# Altium schematic sheet 00_MCU_IO.SchDoc
size A2; SheetNumber: 1; SheetTotal: 5
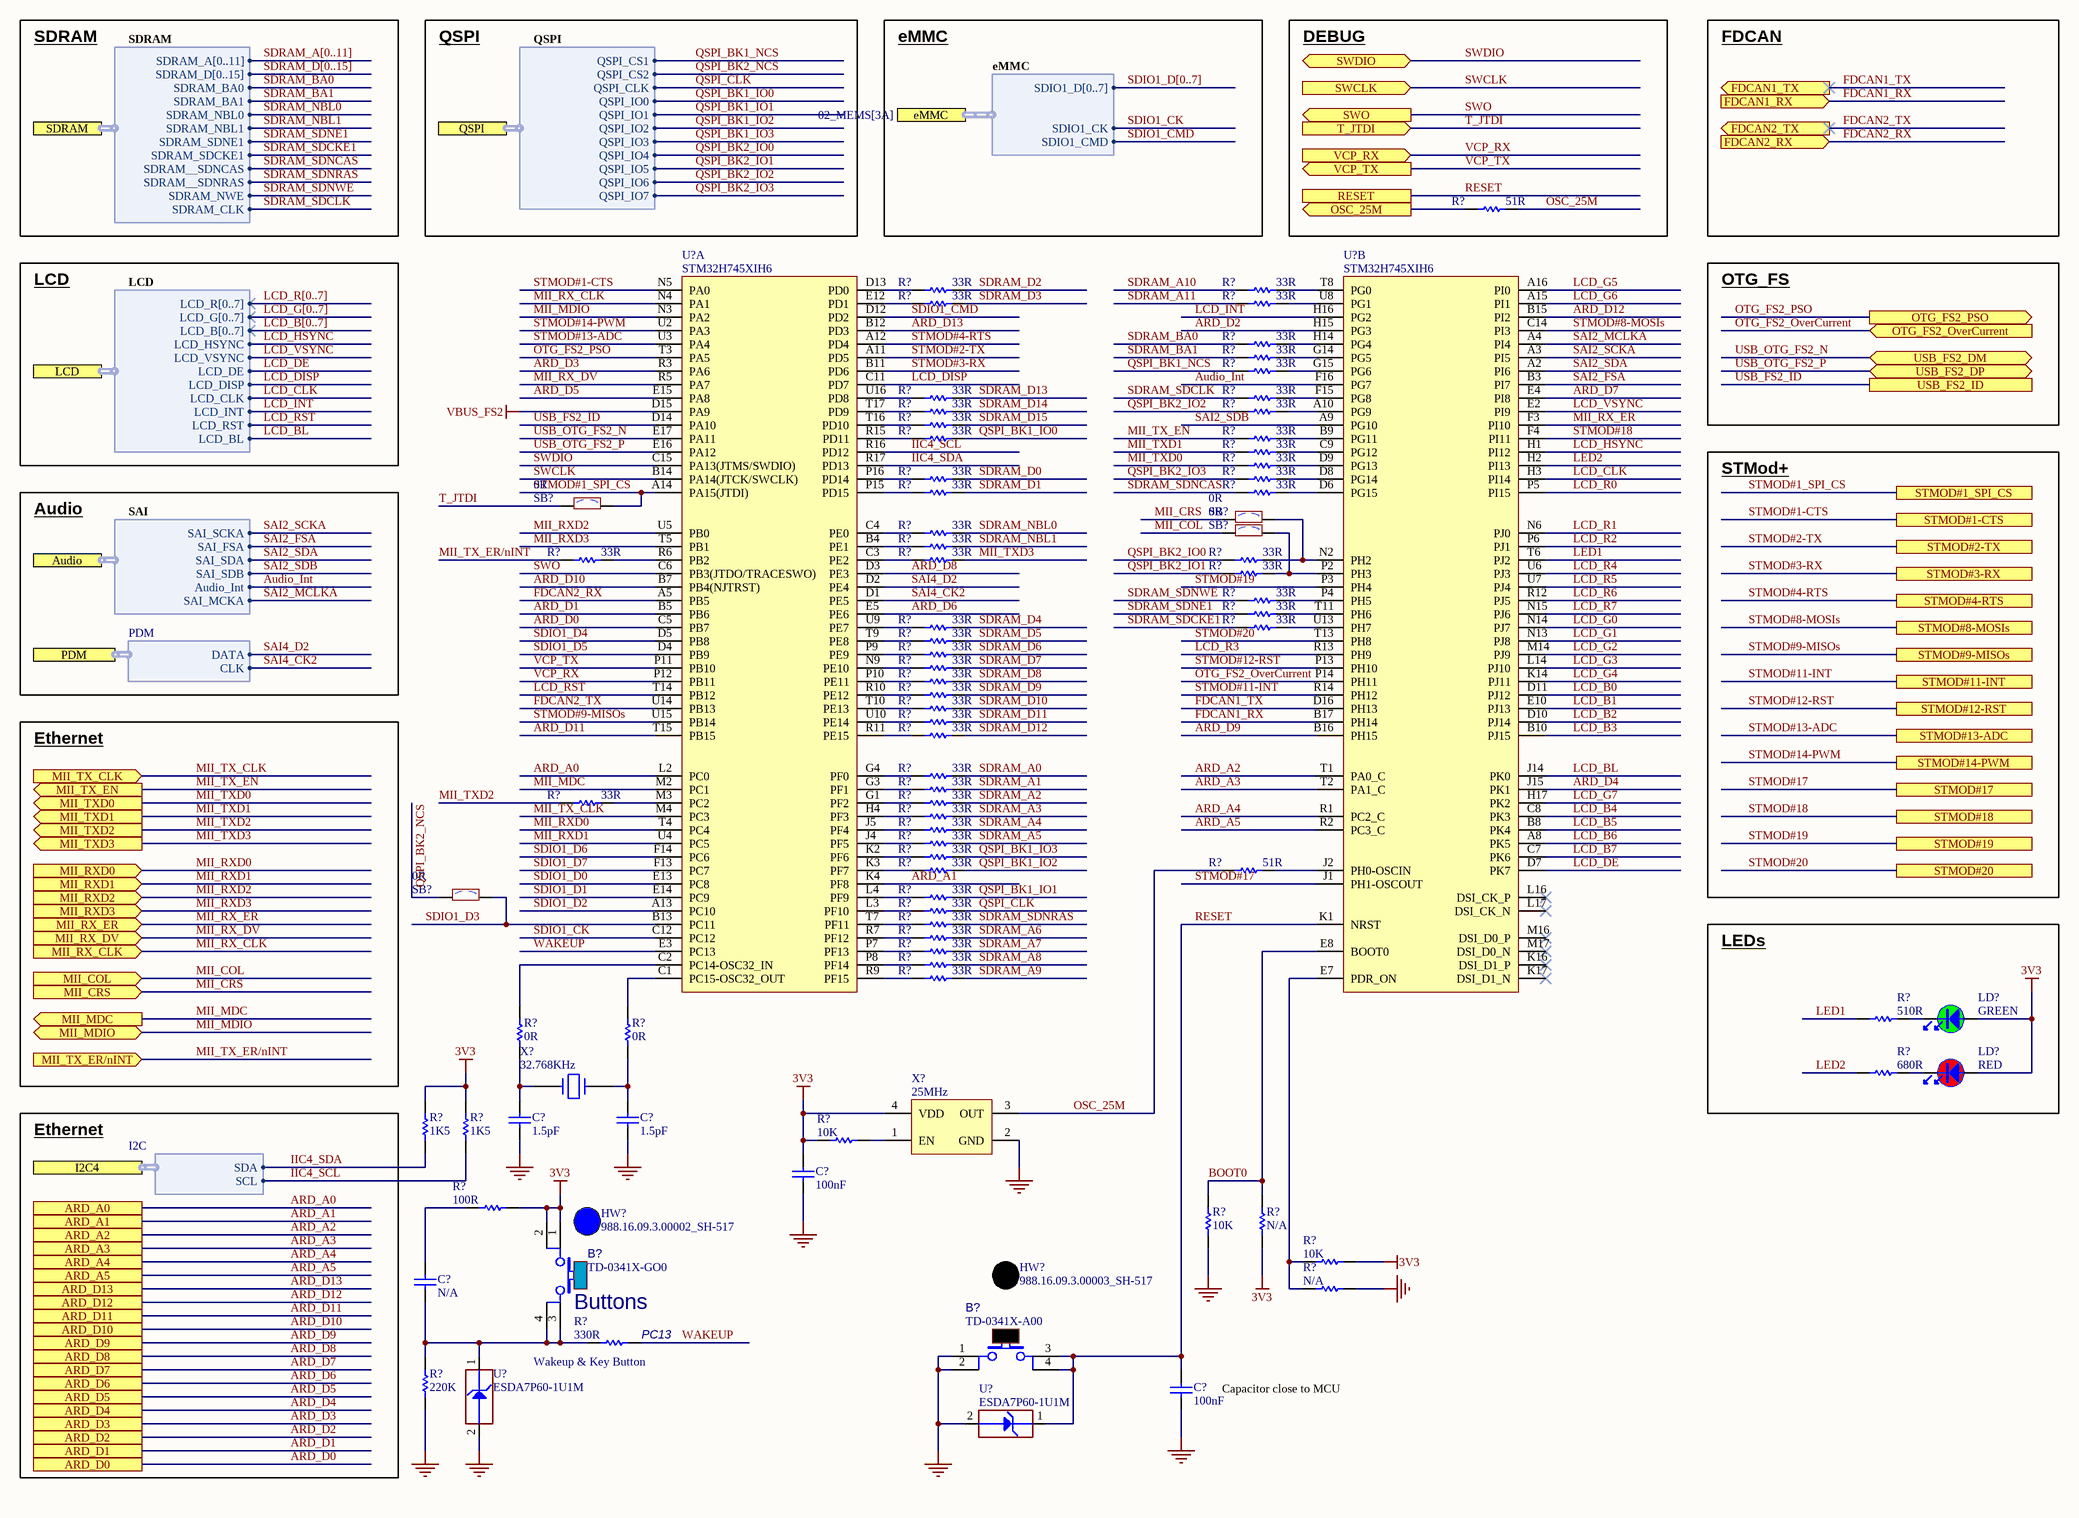
[diagram p0: 00_MCU_IO.SchDoc]

## Parts
(Parts that share a designator on the sheet are numbered #1, #2 ... from top to bottom, then left to right.)
B?#1  Manufacturer_Part_Number: TD-0341X-GO0  [SWI_WEALTHMETAL_TD-0341_4P_BLUE]  (hidden comment: SW-PUSH-CMS_BLUE)
B?#2  Manufacturer_Part_Number: TD-0341X-A00  [SWI_WEALTHMETAL_TD-0341_4P_BLACK]  (hidden comment: SW-PUSH-CMS_BLACK)
C?#1  value 1.5pF  [C0402]  (hidden comment: Capacitor)
C?#2  value 1.5pF  [C0402]  (hidden comment: Capacitor)
C?#3  value 100nF  [C0402]  (hidden comment: Capacitor)
C?#4  N/A  [C0402]
C?#5  value 100nF  [C0402]  (hidden comment: Capacitor)
HW?#1  value 988.16.09.3.00002_SH-517  (hidden comment: BUTTON_HAT_BLUE)  (mechanical)
HW?#2  value 988.16.09.3.00003_SH-517  (hidden comment: BUTTON_HAT_BLACK)  (mechanical)
LD?#1  value GREEN  [LED_0603_GREEN]  (hidden comment: LED_green)
LD?#2  value RED  [LED_0603_RED]  (hidden comment: LED_red)
R?#1  value 51R  [R0402]  (hidden comment: Resistor)
R?#2  value 33R  [R0402]  (hidden comment: Resistor)
R?#3  value 33R  [R0402]  (hidden comment: Resistor)
R?#4  value 33R  [R0402]  (hidden comment: Resistor)
R?#5  value 33R  [R0402]  (hidden comment: Resistor)
R?#6  value 33R  [R0402]  (hidden comment: Resistor)
R?#7  value 33R  [R0402]  (hidden comment: Resistor)
R?#8  value 33R  [R0402]  (hidden comment: Resistor)
R?#9  value 33R  [R0402]  (hidden comment: Resistor)
R?#10  value 33R  [R0402]  (hidden comment: Resistor)
R?#11  value 33R  [R0402]  (hidden comment: Resistor)
R?#12  value 33R  [R0402]  (hidden comment: Resistor)
R?#13  value 33R  [R0402]  (hidden comment: Resistor)
R?#14  value 33R  [R0402]  (hidden comment: Resistor)
R?#15  value 33R  [R0402]  (hidden comment: Resistor)
R?#16  value 33R  [R0402]  (hidden comment: Resistor)
R?#17  value 33R  [R0402]  (hidden comment: Resistor)
R?#18  value 33R  [R0402]  (hidden comment: Resistor)
R?#19  value 33R  [R0402]  (hidden comment: Resistor)
R?#20  value 33R  [R0402]  (hidden comment: Resistor)
R?#21  value 33R  [R0402]  (hidden comment: Resistor)
R?#22  value 33R  [R0402]  (hidden comment: Resistor)
R?#23  value 33R  [R0402]  (hidden comment: Resistor)
R?#24  value 33R  [R0402]  (hidden comment: Resistor)
R?#25  value 33R  [R0402]  (hidden comment: Resistor)
R?#26  value 33R  [R0402]  (hidden comment: Resistor)
R?#27  value 33R  [R0402]  (hidden comment: Resistor)
R?#28  value 33R  [R0402]  (hidden comment: Resistor)
R?#29  value 33R  [R0402]  (hidden comment: Resistor)
R?#30  value 33R  [R0402]  (hidden comment: Resistor)
R?#31  value 33R  [R0402]  (hidden comment: Resistor)
R?#32  value 33R  [R0402]  (hidden comment: Resistor)
R?#33  value 33R  [R0402]  (hidden comment: Resistor)
R?#34  value 33R  [R0402]  (hidden comment: Resistor)
R?#35  value 33R  [R0402]  (hidden comment: Resistor)
R?#36  value 33R  [R0402]  (hidden comment: Resistor)
R?#37  value 33R  [R0402]  (hidden comment: Resistor)
R?#38  value 33R  [R0402]  (hidden comment: Resistor)
R?#39  value 33R  [R0402]  (hidden comment: Resistor)
R?#40  value 33R  [R0402]  (hidden comment: Resistor)
R?#41  value 33R  [R0402]  (hidden comment: Resistor)
R?#42  value 33R  [R0402]  (hidden comment: Resistor)
R?#43  value 33R  [R0402]  (hidden comment: Resistor)
R?#44  value 33R  [R0402]  (hidden comment: Resistor)
R?#45  value 33R  [R0402]  (hidden comment: Resistor)
R?#46  value 33R  [R0402]  (hidden comment: Resistor)
R?#47  value 33R  [R0402]  (hidden comment: Resistor)
R?#48  value 33R  [R0402]  (hidden comment: Resistor)
R?#49  value 51R  [R0402]  (hidden comment: Resistor)
R?#50  value 33R  [R0402]  (hidden comment: Resistor)
R?#51  value 33R  [R0402]  (hidden comment: Resistor)
R?#52  value 33R  [R0402]  (hidden comment: Resistor)
R?#53  value 33R  [R0402]  (hidden comment: Resistor)
R?#54  value 33R  [R0402]  (hidden comment: Resistor)
R?#55  value 33R  [R0402]  (hidden comment: Resistor)
R?#56  value 33R  [R0402]  (hidden comment: Resistor)
R?#57  value 510R  [R0603]  (hidden comment: Resistor)
R?#58  value 0R  [R0603]  (hidden comment: Resistor)
R?#59  value 0R  [R0603]  (hidden comment: Resistor)
R?#60  value 680R  [R0402]  (hidden comment: Resistor)
R?#61  value 1K5  [R0402]  (hidden comment: Resistor)
R?#62  value 1K5  [R0402]  (hidden comment: Resistor)
R?#63  value 10K  [R0402]  (hidden comment: Resistor)
R?#64  value 100R  [R0402]  (hidden comment: Resistor)
R?#65  value 10K  [R0402]  (hidden comment: Resistor)
R?#66  N/A  [R0402]
R?#67  value 10K  [R0402]  (hidden comment: Resistor)
R?#68  N/A  [R0402]
R?#69  value 330R  [R0402]  (hidden comment: Resistor)
R?#70  value 220K  [R0402]  (hidden comment: Resistor)
SB?#1  value 0R  [SOLDER-BRIDGE_R0603-0R]  (hidden comment: SB_OFF)
SB?#2  value 0R  [SOLDER-BRIDGE_R0603-0R]  (hidden comment: SB_OFF)
SB?#3  value 0R  [SOLDER-BRIDGE_R0603-0R]  (hidden comment: SB_OFF)
SB?#4  value 0R  [SOLDER-BRIDGE_R0603-0R]  (hidden comment: SB_OFF)
U?#1  value STM32H745XIH6  [ICC_TFBGA240+25_14X14_STM32H745H6U_P080]  (part A of 3)
U?#2  value STM32H745XIH6  [ICC_TFBGA240+25_14X14_STM32H745H6U_P080]  (part B of 3)
U?#3  value ESDA7P60-1U1M  [ESD_QFN2_1P6X1_P125]  (hidden comment: ESD-TRANSIL)
U?#4  value ESDA7P60-1U1M  [ESD_QFN2_1P6X1_P125]  (hidden comment: ESD-TRANSIL)
X?#1  value 32.768KHz  [CRY_NX3215SA_2P]  (hidden comment: XTAL_32K_NX3215SA)
X?#2  value 25MHz  [OSC_NDK_NZ2520SB_4P]  (hidden comment: Oscillator_4pins)

## Blocks framed on the sheet
DEBUG: R?#1
LEDs: LD?#1 LD?#2 R?#57 R?#60

## Ports
ARD_A0, ARD_A1, ARD_A2, ARD_A3, ARD_A4, ARD_A5, ARD_D0, ARD_D1, ARD_D2, ARD_D3, ARD_D4, ARD_D5, ARD_D6, ARD_D7, ARD_D8, ARD_D9, ARD_D10, ARD_D11, ARD_D12, ARD_D13, Audio (harness SAI), eMMC (harness eMMC, see 02_MEMS[3A]), FDCAN1_RX (in), FDCAN1_TX (out), FDCAN2_RX (in), FDCAN2_TX (out), I2C4 (harness I2C), LCD (harness LCD), MII_COL (in), MII_CRS (in), MII_MDC (out), MII_MDIO (bidir), MII_RX_CLK (in), MII_RX_DV (in), MII_RX_ER (in), MII_RXD0 (in), MII_RXD1 (in), MII_RXD2 (in), MII_RXD3 (in), MII_TX_CLK (in), MII_TX_EN (out), MII_TX_ER/nINT (in), MII_TXD0 (out), MII_TXD1 (out), MII_TXD2 (out), MII_TXD3 (out), OSC_25M (out), OTG_FS2_OverCurrent (in), OTG_FS2_PSO (out), PDM (harness PDM), QSPI (harness QSPI), RESET, SDRAM (harness SDRAM), STMOD#1-CTS, STMOD#1_SPI_CS, STMOD#2-TX, STMOD#3-RX, STMOD#4-RTS, STMOD#8-MOSIs, STMOD#9-MISOs, STMOD#11-INT, STMOD#12-RST, STMOD#13-ADC, STMOD#14-PWM, STMOD#17, STMOD#18, STMOD#19, STMOD#20, SWCLK (in), SWDIO (bidir), SWO (out), T_JTDI (in), USB_FS2_DM (bidir), USB_FS2_DP (bidir), USB_FS2_ID, VCP_RX (in), VCP_TX (out)

## Harnesses
SDRAM: SDRAM_A[0..11], SDRAM__SDNCAS, SDRAM_NBL0, SDRAM_SDNE1, SDRAM_SDCKE1, SDRAM_D[0..15], SDRAM_NBL1, SDRAM_BA0, SDRAM_BA1, SDRAM_NWE, SDRAM_CLK, SDRAM__SDNRAS
LCD: LCD_R[0..7], LCD_G[0..7], LCD_B[0..7], LCD_HSYNC, LCD_VSYNC, LCD_DE, LCD_DISP, LCD_CLK, LCD_INT, LCD_BL, LCD_RST
QSPI: QSPI_IO1, QSPI_IO0, QSPI_CLK, QSPI_CS1, QSPI_IO2, QSPI_IO3, QSPI_IO5, QSPI_IO4, QSPI_IO6, QSPI_IO7, QSPI_CS2
eMMC: SDIO1_D[0..7], SDIO1_CMD, SDIO1_CK
SAI: SAI_SDB, SAI_FSA, Audio_Int, SAI_SDA, SAI_SCKA, SAI_MCKA
I2C: SDA, SCL
PDM: DATA, CLK

## Nets
3V3: B?#1.1 B?#1.2 C?#3.2 LD?#1.1 LD?#2.1 R?#61.2 R?#62.2 R?#63.2 R?#64.2 R?#66.1 R?#67.1 X?#2.4(VDD)
GND: B?#2.1 B?#2.2 C?#1.1 C?#2.1 C?#3.1 C?#5.1 R?#65.2 R?#68.1 R?#70.1 U?#3.2(GND) U?#4.2(GND) X?#2.2(GND)
VBUS_FS2: U?#1.D15(PA9)
ARD_A0: U?#1.L2(PC0) ; port ARD_A0
ARD_A1: U?#1.K4(PF8) ; port ARD_A1
ARD_A2: U?#2.T1(PA0_C) ; port ARD_A2
ARD_A3: U?#2.T2(PA1_C) ; port ARD_A3
ARD_A4: U?#2.R1(PC2_C) ; port ARD_A4
ARD_A5: U?#2.R2(PC3_C) ; port ARD_A5
ARD_D0: U?#1.C5(PB7) ; port ARD_D0
ARD_D1: U?#1.B5(PB6) ; port ARD_D1
ARD_D2: U?#2.H15(PG3) ; port ARD_D2
ARD_D3: U?#1.R3(PA6) ; port ARD_D3
ARD_D4: U?#2.J15(PK1) ; port ARD_D4
ARD_D5: U?#1.E15(PA8) ; port ARD_D5
ARD_D6: U?#1.E5(PE6) ; port ARD_D6
ARD_D7: U?#2.E4(PI8) ; port ARD_D7
ARD_D8: U?#1.D3(PE3) ; port ARD_D8
ARD_D9: U?#2.B16(PH15) ; port ARD_D9
ARD_D10: U?#1.B7(PB4(NJTRST)) ; port ARD_D10
ARD_D11: U?#1.T15(PB15) ; port ARD_D11
ARD_D12: U?#2.B15(PI2) ; port ARD_D12
ARD_D13: U?#1.B12(PD3) ; port ARD_D13
Audio_Int: U?#2.F16(PG7) ; port Audio.Audio_Int
BOOT0: R?#65.1 R?#66.2 U?#2.E8(BOOT0)
FDCAN1_RX: U?#2.B17(PH14) ; port FDCAN1_RX
FDCAN1_TX: U?#2.D16(PH13) ; port FDCAN1_TX
FDCAN2_RX: U?#1.A5(PB5) ; port FDCAN2_RX
FDCAN2_TX: U?#1.U14(PB13) ; port FDCAN2_TX
IIC4_SCL: R?#62.1 U?#1.R16(PD12) ; port I2C4.SCL
IIC4_SDA: R?#61.1 U?#1.R17(PD13) ; port I2C4.SDA
LCD_B0: U?#2.D11(PJ12)
LCD_B1: U?#2.E10(PJ13)
LCD_B2: U?#2.D10(PJ14)
LCD_B3: U?#2.B10(PJ15)
LCD_B4: U?#2.C8(PK3)
LCD_B5: U?#2.B8(PK4)
LCD_B6: U?#2.A8(PK5)
LCD_B7: U?#2.C7(PK6)
LCD_BL: U?#2.J14(PK0) ; port LCD.LCD_BL
LCD_CLK: U?#2.H3(PI14) ; port LCD.LCD_CLK
LCD_DE: U?#2.D7(PK7) ; port LCD.LCD_DE
LCD_DISP: U?#1.C11(PD7) ; port LCD.LCD_DISP
LCD_G0: U?#2.N14(PJ7)
LCD_G1: U?#2.N13(PJ8)
LCD_G2: U?#2.M14(PJ9)
LCD_G3: U?#2.L14(PJ10)
LCD_G4: U?#2.K14(PJ11)
LCD_G5: U?#2.A16(PI0)
LCD_G6: U?#2.A15(PI1)
LCD_G7: U?#2.H17(PK2)
LCD_HSYNC: U?#2.H1(PI12) ; port LCD.LCD_HSYNC
LCD_INT: U?#2.H16(PG2) ; port LCD.LCD_INT
LCD_R0: U?#2.P5(PI15)
LCD_R1: U?#2.N6(PJ0)
LCD_R2: U?#2.P6(PJ1)
LCD_R3: U?#2.R13(PH9)
LCD_R4: U?#2.U6(PJ3)
LCD_R5: U?#2.U7(PJ4)
LCD_R6: U?#2.R12(PJ5)
LCD_R7: U?#2.N15(PJ6)
LCD_RST: U?#1.T14(PB12) ; port LCD.LCD_RST
LCD_VSYNC: U?#2.E2(PI9) ; port LCD.LCD_VSYNC
LED1: R?#57.1 U?#2.T6(PJ2)
LED2: R?#60.1 U?#2.H2(PI13)
MII_COL: SB?#3.1 ; port MII_COL
MII_CRS: SB?#2.1 ; port MII_CRS
MII_MDC: U?#1.M2(PC1) ; port MII_MDC
MII_MDIO: U?#1.N3(PA2) ; port MII_MDIO
MII_RX_CLK: U?#1.N4(PA1) ; port MII_RX_CLK
MII_RX_DV: U?#1.R5(PA7) ; port MII_RX_DV
MII_RX_ER: U?#2.F3(PI10) ; port MII_RX_ER
MII_RXD0: U?#1.T4(PC4) ; port MII_RXD0
MII_RXD1: U?#1.U4(PC5) ; port MII_RXD1
MII_RXD2: U?#1.U5(PB0) ; port MII_RXD2
MII_RXD3: U?#1.T5(PB1) ; port MII_RXD3
MII_TX_CLK: U?#1.M4(PC3) ; port MII_TX_CLK
MII_TX_EN: R?#15.1 ; port MII_TX_EN
MII_TX_ER/nINT: R?#24.1 ; port MII_TX_ER/nINT
MII_TXD0: R?#17.1 ; port MII_TXD0
MII_TXD1: R?#16.1 ; port MII_TXD1
MII_TXD2: R?#42.1 ; port MII_TXD2
MII_TXD3: R?#25.2 ; port MII_TXD3
OSC_25M: R?#1.2 R?#49.1 X?#2.3(OUT)
OSC_25M: R?#1.1 ; port OSC_25M  [a separate net that carries the same name]
OTG_FS2_OverCurrent: U?#2.P14(PH11) ; port OTG_FS2_OverCurrent
OTG_FS2_PSO: U?#1.T3(PA5) ; port OTG_FS2_PSO
QSPI_BK1_IO0: R?#14.2 ; port QSPI.QSPI_IO0
QSPI_BK1_IO1: R?#50.2 ; port QSPI.QSPI_IO1
QSPI_BK1_IO2: R?#48.2 ; port QSPI.QSPI_IO2
QSPI_BK1_IO3: R?#47.2 ; port QSPI.QSPI_IO3
QSPI_BK1_NCS: R?#8.1 ; port QSPI.QSPI_CS1
QSPI_BK2_IO0: R?#26.1 ; port QSPI.QSPI_IO4
QSPI_BK2_IO1: R?#27.1 ; port QSPI.QSPI_IO5
QSPI_BK2_IO2: R?#12.1 ; port QSPI.QSPI_IO6
QSPI_BK2_IO3: R?#19.1 ; port QSPI.QSPI_IO7
QSPI_BK2_NCS: SB?#4.1 ; port QSPI.QSPI_CS2
QSPI_CLK: R?#51.2 ; port QSPI.QSPI_CLK
RESET: B?#2.3 B?#2.4 C?#5.2 U?#2.K1(NRST) U?#4.1(IO1) ; port RESET
SAI2_FSA: U?#2.B3(PI7) ; port Audio.SAI_FSA
SAI2_MCLKA: U?#2.A4(PI4) ; port Audio.SAI_MCKA
SAI2_SCKA: U?#2.A3(PI5) ; port Audio.SAI_SCKA
SAI2_SDA: U?#2.A2(PI6) ; port Audio.SAI_SDA
SAI2_SDB: U?#2.A9(PG10) ; port Audio.SAI_SDB
SAI4_CK2: U?#1.D1(PE5) ; port PDM.CLK
SAI4_D2: U?#1.D2(PE4) ; port PDM.DATA
SDIO1_CK: U?#1.C12(PC12) ; port eMMC.SDIO1_CK
SDIO1_CMD: U?#1.D12(PD2) ; port eMMC.SDIO1_CMD
SDIO1_D0: U?#1.E13(PC8)
SDIO1_D1: U?#1.E14(PC9)
SDIO1_D2: U?#1.A13(PC10)
SDIO1_D3: SB?#4.2 U?#1.B13(PC11)
SDIO1_D4: U?#1.D5(PB8)
SDIO1_D5: U?#1.D4(PB9)
SDIO1_D6: U?#1.F14(PC6)
SDIO1_D7: U?#1.F13(PC7)
SDRAM_A0: R?#40.2
SDRAM_A1: R?#41.2
SDRAM_A2: R?#43.2
SDRAM_A3: R?#44.2
SDRAM_A4: R?#45.2
SDRAM_A5: R?#46.2
SDRAM_A6: R?#53.2
SDRAM_A7: R?#54.2
SDRAM_A8: R?#55.2
SDRAM_A9: R?#56.2
SDRAM_A10: R?#3.1
SDRAM_A11: R?#5.1
SDRAM_BA0: R?#6.1 ; port SDRAM.SDRAM_BA0
SDRAM_BA1: R?#7.1 ; port SDRAM.SDRAM_BA1
SDRAM_D0: R?#18.2
SDRAM_D1: R?#20.2
SDRAM_D2: R?#2.2
SDRAM_D3: R?#4.2
SDRAM_D4: R?#30.2
SDRAM_D5: R?#32.2
SDRAM_D6: R?#33.2
SDRAM_D7: R?#34.2
SDRAM_D8: R?#35.2
SDRAM_D9: R?#36.2
SDRAM_D10: R?#37.2
SDRAM_D11: R?#38.2
SDRAM_D12: R?#39.2
SDRAM_D13: R?#9.2
SDRAM_D14: R?#11.2
SDRAM_D15: R?#13.2
SDRAM_NBL0: R?#22.2 ; port SDRAM.SDRAM_NBL0
SDRAM_NBL1: R?#23.2 ; port SDRAM.SDRAM_NBL1
SDRAM_SDCKE1: R?#31.1 ; port SDRAM.SDRAM_SDCKE1
SDRAM_SDCLK: R?#10.1 ; port SDRAM.SDRAM_CLK
SDRAM_SDNCAS: R?#21.1 ; port SDRAM.SDRAM__SDNCAS
SDRAM_SDNE1: R?#29.1 ; port SDRAM.SDRAM_SDNE1
SDRAM_SDNRAS: R?#52.2 ; port SDRAM.SDRAM__SDNRAS
SDRAM_SDNWE: R?#28.1 ; port SDRAM.SDRAM_NWE
STMOD#1-CTS: U?#1.N5(PA0) ; port STMOD#1-CTS
STMOD#1_SPI_CS: SB?#1.2 U?#1.A14(PA15(JTDI)) ; port STMOD#1_SPI_CS
STMOD#2-TX: U?#1.A11(PD5) ; port STMOD#2-TX
STMOD#3-RX: U?#1.B11(PD6) ; port STMOD#3-RX
STMOD#4-RTS: U?#1.A12(PD4) ; port STMOD#4-RTS
STMOD#8-MOSIs: U?#2.C14(PI3) ; port STMOD#8-MOSIs
STMOD#9-MISOs: U?#1.U15(PB14) ; port STMOD#9-MISOs
STMOD#11-INT: U?#2.R14(PH12) ; port STMOD#11-INT
STMOD#12-RST: U?#2.P13(PH10) ; port STMOD#12-RST
STMOD#13-ADC: U?#1.U3(PA4) ; port STMOD#13-ADC
STMOD#14-PWM: U?#1.U2(PA3) ; port STMOD#14-PWM
STMOD#17: U?#2.J1(PH1-OSCOUT) ; port STMOD#17
STMOD#18: U?#2.F4(PI11) ; port STMOD#18
STMOD#19: U?#2.P3(PH4) ; port STMOD#19
STMOD#20: U?#2.T13(PH8) ; port STMOD#20
SWCLK: U?#1.B14(PA14(JTCK/SWCLK)) ; port SWCLK
SWDIO: U?#1.C15(PA13(JTMS/SWDIO)) ; port SWDIO
SWO: U?#1.C6(PB3(JTDO/TRACESWO)) ; port SWO
T_JTDI: SB?#1.1 ; port T_JTDI
USB_FS2_ID: U?#1.D14(PA10) ; port USB_FS2_ID
USB_OTG_FS2_N: U?#1.E17(PA11) ; port USB_FS2_DM
USB_OTG_FS2_P: U?#1.E16(PA12) ; port USB_FS2_DP
VCP_RX: U?#1.P12(PB11) ; port VCP_RX
VCP_TX: U?#1.P11(PB10) ; port VCP_TX
WAKEUP: R?#69.2 U?#1.E3(PC13)
NetB?#1_3: B?#1.3 B?#1.4 C?#4.2 R?#69.1 R?#70.2 U?#3.1(IO1)
NetC?#1_2: C?#1.2 R?#58.2 X?#1.1
NetC?#2_2: C?#2.2 R?#59.2 X?#1.2
NetC?#4_1: C?#4.1 R?#64.1
NetLD?#1_2: LD?#1.2 R?#57.2
NetLD?#2_2: LD?#2.2 R?#60.2
NetR?#2_1: R?#2.1 U?#1.D13(PD0)
NetR?#3_2: R?#3.2 U?#2.T8(PG0)
NetR?#4_1: R?#4.1 U?#1.E12(PD1)
NetR?#5_2: R?#5.2 U?#2.U8(PG1)
NetR?#6_2: R?#6.2 U?#2.H14(PG4)
NetR?#7_2: R?#7.2 U?#2.G14(PG5)
NetR?#8_2: R?#8.2 U?#2.G15(PG6)
NetR?#9_1: R?#9.1 U?#1.U16(PD8)
NetR?#10_2: R?#10.2 U?#2.F15(PG8)
NetR?#11_1: R?#11.1 U?#1.T17(PD9)
NetR?#12_2: R?#12.2 U?#2.A10(PG9)
NetR?#13_1: R?#13.1 U?#1.T16(PD10)
NetR?#14_1: R?#14.1 U?#1.R15(PD11)
NetR?#15_2: R?#15.2 U?#2.B9(PG11)
NetR?#16_2: R?#16.2 U?#2.C9(PG12)
NetR?#17_2: R?#17.2 U?#2.D9(PG13)
NetR?#18_1: R?#18.1 U?#1.P16(PD14)
NetR?#19_2: R?#19.2 U?#2.D8(PG14)
NetR?#20_1: R?#20.1 U?#1.P15(PD15)
NetR?#21_2: R?#21.2 U?#2.D6(PG15)
NetR?#22_1: R?#22.1 U?#1.C4(PE0)
NetR?#23_1: R?#23.1 U?#1.B4(PE1)
NetR?#24_2: R?#24.2 U?#1.R6(PB2)
NetR?#25_1: R?#25.1 U?#1.C3(PE2)
NetR?#26_2: R?#26.2 SB?#2.2 U?#2.N2(PH2)
NetR?#27_2: R?#27.2 SB?#3.2 U?#2.P2(PH3)
NetR?#28_2: R?#28.2 U?#2.P4(PH5)
NetR?#29_2: R?#29.2 U?#2.T11(PH6)
NetR?#30_1: R?#30.1 U?#1.U9(PE7)
NetR?#31_2: R?#31.2 U?#2.U13(PH7)
NetR?#32_1: R?#32.1 U?#1.T9(PE8)
NetR?#33_1: R?#33.1 U?#1.P9(PE9)
NetR?#34_1: R?#34.1 U?#1.N9(PE10)
NetR?#35_1: R?#35.1 U?#1.P10(PE11)
NetR?#36_1: R?#36.1 U?#1.R10(PE12)
NetR?#37_1: R?#37.1 U?#1.T10(PE13)
NetR?#38_1: R?#38.1 U?#1.U10(PE14)
NetR?#39_1: R?#39.1 U?#1.R11(PE15)
NetR?#40_1: R?#40.1 U?#1.G4(PF0)
NetR?#41_1: R?#41.1 U?#1.G3(PF1)
NetR?#42_2: R?#42.2 U?#1.M3(PC2)
NetR?#43_1: R?#43.1 U?#1.G1(PF2)
NetR?#44_1: R?#44.1 U?#1.H4(PF3)
NetR?#45_1: R?#45.1 U?#1.J5(PF4)
NetR?#46_1: R?#46.1 U?#1.J4(PF5)
NetR?#47_1: R?#47.1 U?#1.K2(PF6)
NetR?#48_1: R?#48.1 U?#1.K3(PF7)
NetR?#49_2: R?#49.2 U?#2.J2(PH0-OSCIN)
NetR?#50_1: R?#50.1 U?#1.L4(PF9)
NetR?#51_1: R?#51.1 U?#1.L3(PF10)
NetR?#52_1: R?#52.1 U?#1.T7(PF11)
NetR?#53_1: R?#53.1 U?#1.R7(PF12)
NetR?#54_1: R?#54.1 U?#1.P7(PF13)
NetR?#55_1: R?#55.1 U?#1.P8(PF14)
NetR?#56_1: R?#56.1 U?#1.R9(PF15)
NetR?#58_1: R?#58.1 U?#1.C2(PC14-OSC32_IN)
NetR?#59_1: R?#59.1 U?#1.C1(PC15-OSC32_OUT)
NetR?#63_1: R?#63.1 X?#2.1(EN)
NetR?#67_2: R?#67.2 R?#68.2 U?#2.E7(PDR_ON)

Not connected (* = marked no-connect by the designer): U?#2 K16(DSI_D1_P)* K17(DSI_D1_N)* L16(DSI_CK_P)* L17(DSI_CK_N)* M16(DSI_D0_P)* M17(DSI_D0_N)*

## Buses and harness runs
bus LCD_B[0..7]
bus LCD_G[0..7]
bus LCD_R[0..7]
bus SDIO1_D[0..7]
bus SDRAM_A[0..11]
bus SDRAM_D[0..15]

## Notes on the sheet
- SDRAM
- QSPI
- eMMC
- FDCAN
- LCD
- OTG_FS
- Audio
- STMod+
- Ethernet
- (near B?#1) Buttons
- (near R?#69) PC13
- (near R?#69) Wakeup & Key Button
- (near C?#5) Capacitor close to MCU

## Library data of the parts
B?#1 = MCD-00002: Non-Open Push-Button 0.1A 24V BLUE; Part_Type: Misc; Manufacturer: WEALTHMETAL; Part_Preference: Not recommended; Partial_Alternate_Internal_Part_Number: MCD-03589; Value: TD-0341X-GO0; Provided_By: Subcon; Initial_Board_Reference: MB1274; Alternate_EMS: A; Component_Country_Of_Origin: Unknown; ID: 2464; ShowFields: YES; Internal_Part_Number: MCD-00002; Status: Checked; ComponentLink1Description: Datasheet; ComponentLink1URL: http://tunmcdsvn.tun.st.com/Component_Documentation_Library/Trunk/Misc/WEALTHMETAL_TD-0341; Order_Code_Farnell: N/A; Manufacturer_HQ_COO: Unknown; Order_Code_Digikey: N/A; Order_Code_RS: N/A; Package: 6x10mm
B?#2 = MCD-00001: Non-Open Push-Button 0.1A 24V BLACK; Part_Type: Misc; Manufacturer: WEALTHMETAL; Part_Preference: Not recommended; Partial_Alternate_Internal_Part_Number: MCD-03587; Value: TD-0341X-A00; Provided_By: Subcon; Initial_Board_Reference: MB1274; Alternate_EMS: A; Component_Country_Of_Origin: Unknown; ID: 2463; ShowFields: YES; Internal_Part_Number: MCD-00001; Status: Released; ComponentLink1Description: Datasheet; ComponentLink1URL: http://tunmcdsvn.tun.st.com/Component_Documentation_Library/Trunk/Misc/WEALTHMETAL_TD-0341; Order_Code_Farnell: N/A; Order_Code_Digikey: N/A; Order_Code_RS: N/A; Package: 6x10mm
C?#1 C?#2 = MCD-00563: Capacitor, MLCC, 1.5pF, 50V, NPO, +-0.25pF, 0402, T=0,5mm; Manufacturer_Part_Number: CC0402CRNPO9BN1R5; Manufacturer: YAGEO; Part_Preference: Recommended; Partial_Alternate_Internal_Part_Number: MCD-01460; Provided_By: Subcon; Initial_Board_Reference: MB1331; Component_Country_Of_Origin: China; ID: 3175; ShowFields: YES; Internal_Part_Number: MCD-00563; Status: Released; Part_Type: Capacitor; Package: 0402; ComponentLink1Description: Yageo_Capacitor_NP0_16V-to-50V.pdf; ComponentLink1URL: http://tunmcdsvn.tun.st.com/Component_Documentation_Library/Trunk/Capacitor/YAGEO_NP0_Series; ECCN_US: n/a; ECCN_EU: n/a; Order_Code_Digikey: 311-1003-1-ND; Order_Code_Farnell: 3019111; Order_Code_RS: N/A
C?#3-C?#5 = MCD-00006: Capacitor, MLCC, 100nF, 16V, X7R, +/-10%, 0402, T=0.5mm; Manufacturer_Part_Number: CC0402KRX7R7BB104; Manufacturer: YAGEO; Part_Preference: Recommended; Partial_Alternate_Internal_Part_Number: MCD-03299; Component_Country_Of_Origin: China; ID: 2474; Order_Code_RS: 9402047; ShowFields: YES; Internal_Part_Number: MCD-00006; Status: Released; Part_Type: Capacitor; Package: 0402; ComponentLink1URL: http://tunmcdsvn.tun.st.com/Component_Documentation_Library/Trunk/Capacitor/YAGEO_X7R_Series; Order_Code_Digikey: 311-1338-1-ND; Order_Code_Farnell: 9402047
  C?#4: Value: 100nF
HW?#1 = MCD-00634: Blue Hat for switch TD0341X-G01-BLU; Part_Type: Mechanical; Manufacturer: JIUBABA; Part_Preference: Alternate; Provided_By: Subcon; Initial_Board_Reference: mb1319; Alternate_EMS: A; Component_Country_Of_Origin: Unknown; ID: 3112; ShowFields: YES; Internal_Part_Number: MCD-00634; Status: Released; Manufacturer_Part_Number: 988.16.09.3.00002_SH-517; ECCN_US: n/a; ECCN_EU: n/a; ComponentLink1Description: Juibaba_HAT_SH-517.pdf; ComponentLink1URL: http://tunmcdsvn.tun.st.com/Component_Documentation_Library/Trunk/Misc/JIUBABA_988.16.09.3.00002_SH-517; Order_Code_Digikey: N/A; Order_Code_Farnell: N/A; Order_Code_RS: N/A; Package: diameter=4.5mm; Manufacturer_HQ_COO: Unknown
HW?#2 = MCD-00635: Black Hat for switch TD0341X-G01-BLA; Part_Type: Mechanical; Manufacturer: JIUBABA; Part_Preference: Alternate; Provided_By: Subcon; Initial_Board_Reference: mb1319; Alternate_EMS: A; Component_Country_Of_Origin: Unknown; ID: 3106; ShowFields: YES; Internal_Part_Number: MCD-00635; Status: Released; Manufacturer_Part_Number: 988.16.09.3.00003_SH-517; ECCN_US: n/a; ECCN_EU: n/a; ComponentLink1Description: Juibaba_HAT_SH-517.pdf; ComponentLink1URL: http://tunmcdsvn.tun.st.com/Component_Documentation_Library/Trunk/Misc/JIUBABA_988.16.09.3.00003_SH-517; Order_Code_Digikey: N/A; Order_Code_Farnell: N/A; Order_Code_RS: N/A; Package: diameter=4.5mm; Manufacturer_HQ_COO: Unknown
LD?#1 = MCD-02900: LED, Green, 2V, 25mA, 0603, SMD; Part_Type: Display; Part_Preference: Recommended; Manufacturer: EVERLIGHT; Manufacturer_Part_Number: 19-213SYGC/S530-E2/5T; Full_Alternate_Internal_Part_Number: MCD-00320; Partial_Alternate_Internal_Part_Number: MCD-00050; Component_Country_Of_Origin: China; ShowFields: YES; ID: 5016; Internal_Part_Number: MCD-02900; Status: Checked; Package: 0603; ComponentLink1URL: http://tunmcdsvn.tun.st.com/Component_Documentation_Library/Trunk/Display/EVERLIGHT_19-213SYGC-S530-E2-5T; Order_Code_Digikey: 1080-19-213SYGC/S530-E2/5TTR-ND; Order_Code_Farnell: N/A; Order_Code_RS: N/A
LD?#2 = MCD-02899: LED, Red, VF : Min=1.75V , Max=2.35V, 25mA, 0603; Part_Type: Display; Part_Preference: Recommended; Manufacturer: EVERLIGHT; Manufacturer_Part_Number: 19-213/R6C-AP1Q2B/5T; Full_Alternate_Internal_Part_Number: MCD-00049; Component_Country_Of_Origin: China; ShowFields: YES; ID: 5015; Internal_Part_Number: MCD-02899; Status: Checked; Package: 0603; ComponentLink1URL: http://tunmcdsvn.tun.st.com/Component_Documentation_Library/Trunk/Display/EVERLIGHT_19-213-R6C-AP1Q2B-5T; Order_Code_Digikey: 1080-19-213/R6C-AP1Q2B/5TTR-ND; Order_Code_Farnell: N/A; Order_Code_RS: N/A
R?#1 R?#49 = MCD-00485: Resistor,51R,0402,1%,1/16W; Manufacturer_Part_Number: RC0402FR-0751RL; Manufacturer: YAGEO; Part_Preference: Recommended; Provided_By: Subcon; Component_Country_Of_Origin: China; ID: 2790; ShowFields: YES; Internal_Part_Number: MCD-00485; Status: Released; Part_Type: Resistor; Package: 0402; ComponentLink1Description: Yageo_Resistor_RC0402-series.pdf; ComponentLink1URL: http://tunmcdsvn.tun.st.com/Component_Documentation_Library/Trunk/Resistor/YAGEO_RC_L_Series; ECCN_US: n/a; ECCN_EU: n/a; Order_Code_Digikey: 311-51.0LRCT-ND; Order_Code_Farnell: 1458803; Order_Code_RS: N/A
R?#2-R?#48 R?#50-R?#56 = MCD-00455: Resistor,33R,0402,1%,1/16W; Manufacturer_Part_Number: RC0402FR-0733RL; Manufacturer: YAGEO; Part_Preference: Recommended; Provided_By: Subcon; Component_Country_Of_Origin: China; ID: 2821; ShowFields: YES; Internal_Part_Number: MCD-00455; Status: Released; Part_Type: Resistor; Package: 0402; ComponentLink1Description: Yageo_Resistor_RC0402-series.pdf; ComponentLink1URL: http://tunmcdsvn.tun.st.com/Component_Documentation_Library/Trunk/Resistor/YAGEO_RC_L_Series; ECCN_US: n/a; ECCN_EU: n/a; Order_Code_Digikey: 311-33.0LRCT-ND; Order_Code_Farnell: 9239057; Order_Code_RS: N/A
R?#57 = MCD-00225: Resistor,510R,0603,1%,1/10W; Manufacturer_Part_Number: RC0603FR-07510RL; Manufacturer: YAGEO; Part_Preference: Recommended; Provided_By: Subcon; Initial_Board_Reference: mb1319; Component_Country_Of_Origin: China; ID: 2644; ShowFields: YES; Internal_Part_Number: MCD-00225; ECCN_US: n/a; ECCN_EU: n/a; ComponentLink1Description: Yageo_Resistor_RC0603-series.pdf; Status: Released; Part_Type: Resistor; Package: 0603; ComponentLink1URL: http://tunmcdsvn.tun.st.com/Component_Documentation_Library/Trunk/Resistor/YAGEO_RC_L_Series; Order_Code_Digikey: 311-510HRCT-ND; Order_Code_Farnell: 1799351; Order_Code_RS: N/A
R?#58 R?#59 = MCD-00181: Resistor,0R,0603,ULO; Manufacturer_Part_Number: PMR03EZPJ000; Manufacturer: ROHM SEMICONDUCTOR; Part_Preference: Recommended; Provided_By: Subcon; Component_Country_Of_Origin: Philippines, Thailand°°; ID: 2691; ShowFields: YES; Internal_Part_Number: MCD-00181; Status: Released; Part_Type: Resistor; Package: 0603; ComponentLink1Description: ROHM_ULtra low Ohmic Resistor _PMR10EZPJ000.pdf; ComponentLink1URL: http://tunmcdsvn.tun.st.com/Component_Documentation_Library/Trunk/Resistor/ROHM_PMR_Series; ECCN_US: n/a; ECCN_EU: n/a; Order_Code_Digikey: PMR03EZPJ000-ND; Order_Code_Farnell: N/A; Order_Code_RS: N/A
R?#60 = MCD-00507: Resistor,680R,0402,1%,1/16W; Manufacturer_Part_Number: RC0402FR-07680RL; Manufacturer: YAGEO; Part_Preference: Recommended; Provided_By: Subcon; Component_Country_Of_Origin: China; ID: 3238; ShowFields: YES; Internal_Part_Number: MCD-00507; Status: Released; Part_Type: Resistor; Package: 0402; ComponentLink1Description: Yageo_Resistor_RC0402-series.pdf; ComponentLink1URL: http://tunmcdsvn.tun.st.com/Component_Documentation_Library/Trunk/Resistor/YAGEO_RC_L_Series; ECCN_US: n/a; ECCN_EU: n/a; Order_Code_Digikey: 311-680LRCT-ND; Order_Code_Farnell: 9239219; Order_Code_RS: N/A
R?#61 R?#62 = MCD-00068: Resistor,1K5,0402,1%,1/16W; Manufacturer_Part_Number: RC0402FR-071K5L; Manufacturer: YAGEO; Part_Preference: Recommended; Provided_By: Subcon; Initial_Board_Reference: MB1274; Component_Country_Of_Origin: China; ID: 2524; Order_Code_RS: 9239251; ShowFields: YES; Internal_Part_Number: MCD-00068; Status: Released; Part_Type: Resistor; Package: 0402; ComponentLink1Description: Datasheet; ComponentLink1URL: http://tunmcdsvn.tun.st.com/Component_Documentation_Library/Trunk/Resistor/YAGEO_RC_L_Series; Order_Code_Digikey: 311-1.50KLRCT-ND; Order_Code_Farnell: 9239251
R?#63 R?#65-R?#68 = MCD-00053: Resistor,10K,0402,1%,1/16W; Manufacturer_Part_Number: RC0402FR-0710KL; Manufacturer: YAGEO; BMS_Part_Number: 9131590; Part_Preference: Recommended; Provided_By: subcon; Initial_Board_Reference: MB1274; Component_Country_Of_Origin: China; ID: 2539; Order_Code_RS: 9239359; ShowFields: YES; Internal_Part_Number: MCD-00053; Status: Released; Part_Type: Resistor; Package: 0402; ComponentLink1Description: Yageo_Resistor_RC0402-series.pdf; ComponentLink1URL: http://tunmcdsvn.tun.st.com/Component_Documentation_Library/Trunk/Resistor/YAGEO_RC_L_Series; ECCN_US: n/a; ECCN_EU: n/a; Order_Code_Digikey: 311-10.0KLRCT-ND; Order_Code_Farnell: 9239359
  R?#66 R?#68: Value: 10K
R?#64 = MCD-00067: Resistor, 100R, 0402, +/- 1%, 1/16W; Manufacturer_Part_Number: RC0402FR-07100RL; Manufacturer: YAGEO; Part_Preference: Recommended; Component_Country_Of_Origin: China; ID: 2527; Order_Code_RS: 9239111; ShowFields: YES; Internal_Part_Number: MCD-00067; Status: Released; Part_Type: Resistor; Package: 0402; ComponentLink1URL: http://tunmcdsvn.tun.st.com/Component_Documentation_Library/Trunk/Resistor/YAGEO_RC_L_Series; Order_Code_Digikey: 311-100LRCT-ND; Order_Code_Farnell: 9239111
R?#69 = MCD-00062: Resistor,330R,0402,1%,1/16W; Manufacturer_Part_Number: RC0402FR-07330RL; Manufacturer: YAGEO; Part_Preference: Recommended; Provided_By: Subcon; Initial_Board_Reference: MB1274; Component_Country_Of_Origin: China; ID: 2529; Order_Code_RS: 9239170; ShowFields: YES; Internal_Part_Number: MCD-00062; Status: Released; Part_Type: Resistor; Package: 0402; ComponentLink1Description: Yageo_Resistor_RC0402-series.pdf; ComponentLink1URL: http://tunmcdsvn.tun.st.com/Component_Documentation_Library/Trunk/Resistor/YAGEO_RC_L_Series; ECCN_US: n/a; ECCN_EU: n/a; Order_Code_Digikey: 311-330LRCT-ND; Order_Code_Farnell: 9239170
R?#70 = MCD-00164: Resistor,220K,0402,1%,1/16W; Manufacturer_Part_Number: RC0402FR-07220KL; Manufacturer: YAGEO; Part_Preference: Recommended; Provided_By: Subcon; Initial_Board_Reference: MB1264; Component_Country_Of_Origin: China; ID: 2704; ShowFields: YES; Internal_Part_Number: MCD-00164; Status: Released; Part_Type: Resistor; Package: 0402; ComponentLink1Description: Yageo_Resistor_RC0402-series.pdf; ComponentLink1URL: http://tunmcdsvn.tun.st.com/Component_Documentation_Library/Trunk/Resistor/YAGEO_RC_L_Series; ECCN_US: n/a; ECCN_EU: n/a; Order_Code_Digikey: 311-220KLRCT-ND; Order_Code_Farnell: 9239510; Order_Code_RS: N/A
SB?#1-SB?#4 = MCD-00072: Solder Bridge OFF; Part_Type: Resistor; Manufacturer: YAGEO; Manufacturer_HQ_COO: Unknown; Manufacturer_Part_Number: RC0603JR-070RL; Part_Preference: Recommended; Initial_Board_Reference: mb1274; Component_Country_Of_Origin: China; ID: 2520; Order_Code_RS: 199-5647; ShowFields: YES; Internal_Part_Number: MCD-00072; Status: Released; ECCN_US: n/a; ECCN_EU: n/a; Provided_By: n/a; ComponentLink1URL: http://tunmcdsvn.tun.st.com/Component_Documentation_Library/Trunk/Resistor/YAGEO_RC_Series; Order_Code_Digikey: 311-0.0GRTR-ND; Order_Code_Farnell: 2421846; Package: 0603
U?#1 U?#2 = MCD-01085: 32bit MCU TFBGA240+25; Part_Type: IC; Manufacturer: STMICROELECTRONICS; BMS_Part_Number: 9175307; Manufacturer_HQ_COO: EU; Part_Preference: Recommended; Provided_By: STM; Initial_Board_Reference: MB1381; Component_Country_Of_Origin: Philippines; ID: 3408; ShowFields: YES; Internal_Part_Number: MCD-01085; Status: Checked; Manufacturer_Part_Number: STM32H745XIH6; Package: TFBGA-265; ComponentLink1Description: Datasheet; ComponentLink1URL: http://tunmcdsvn.tun.st.com/Component_Documentation_Library/Trunk/IC/STMICROELECTRONICS_STM32H745x; Order_Code_Digikey: 497-19502-ND; Order_Code_Farnell: 3365366; Order_Code_RS: N/A
U?#3 U?#4 = MCD-00251: High power transient voltage suppressor, 7V breakdown; Part_Type: Diode; Manufacturer: STMICROELECTRONICS; BMS_Part_Number: 9179042; Manufacturer_HQ_COO: EU; Part_Preference: Recommended; ECCN_US: EAR99; ECCN_EU: NEC; Provided_By: Subcon; Initial_Board_Reference: MB1311; Component_Country_Of_Origin: China; ID: 2618; Order_Code_RS: 110-6381; ShowFields: YES; Internal_Part_Number: MCD-00251; Status: Released; Manufacturer_Part_Number: ESDA7P60-1U1M; ComponentLink1Description: STM_ESD_ESDA7P60-1U1M.pdf; ComponentLink1URL: http://tunmcdsvn.tun.st.com/Component_Documentation_Library/Trunk/Diode/STMICROELECTRONICS_ESDA7P60-1U1M; Order_Code_Digikey: 497-16253-2-ND; Order_Code_Farnell: N/A; Package: QFN1610
X?#1 = MCD-00091: Crystal 32.768kHz, 6pF, -+20PPM, R=50K, SMD; Part_Type: Crystal_Osc; Manufacturer_Part_Number: NX3215SA-32.768KHZ-EXS00A-MU00525; Manufacturer: NDK; BMS_Part_Number: 9157034; Part_Preference: Recommended; ECCN_US: EAR99; ECCN_EU: NEC; Provided_By: STM; Initial_Board_Reference: mb1274; Component_Country_Of_Origin: Unknown; ID: 2553; ShowFields: YES; Internal_Part_Number: MCD-00091; Status: Released; ComponentLink1Description: NDK_Crystal-For-ST_NX3215SA 32.768KHz EXS00A-MU00525 (EXS10B-21238).pdf; ComponentLink1URL: http://tunmcdsvn.tun.st.com/Component_Documentation_Library/Trunk/Crystal_Oscillator/NDK_NX3215SA_Series; Order_Code_Digikey: 644-1386; Order_Code_Farnell: N/A; Order_Code_RS: N/A; Package: 3.2x1.5mm
X?#2 = MCD-00597: Oscillator 25.00Mhz, -+50PPM, 3.3V, Temp -55 to +125°C; Part_Type: Crystal_Osc; Manufacturer_Part_Number: NZ2520SH-25MHZ-END4869C; Manufacturer: NDK; Alternate_Manufacturer_Part_Number: KC2520B25.0000C10E00; Alternate_Manufacturer: AVX CORP/KYOCERA CORP; BMS_Part_Number: 9157050; Part_Preference: Recommended; Provided_By: STM; Initial_Board_Reference: MB1331; Component_Country_Of_Origin: Unknown; ID: 3148; ShowFields: YES; Internal_Part_Number: MCD-00597; Status: Released; ComponentLink1Description: NDK_OSCILLATOR_NZ2520SB.pdf; ComponentLink1URL: http://tunmcdsvn.tun.st.com/Component_Documentation_Library/Trunk/Crystal_Oscillator/NDK_NZ2520SH_Series; Order_Code_Digikey: N/A; ECCN_US: n/a; ECCN_EU: n/a; Order_Code_Farnell: N/A; Order_Code_RS: N/A; Package: 2.5x2.0mm